# Altium schematic sheet 04_MCU-Part1.SchDoc
size A3; SheetNumber: 4; SheetTotal: 7
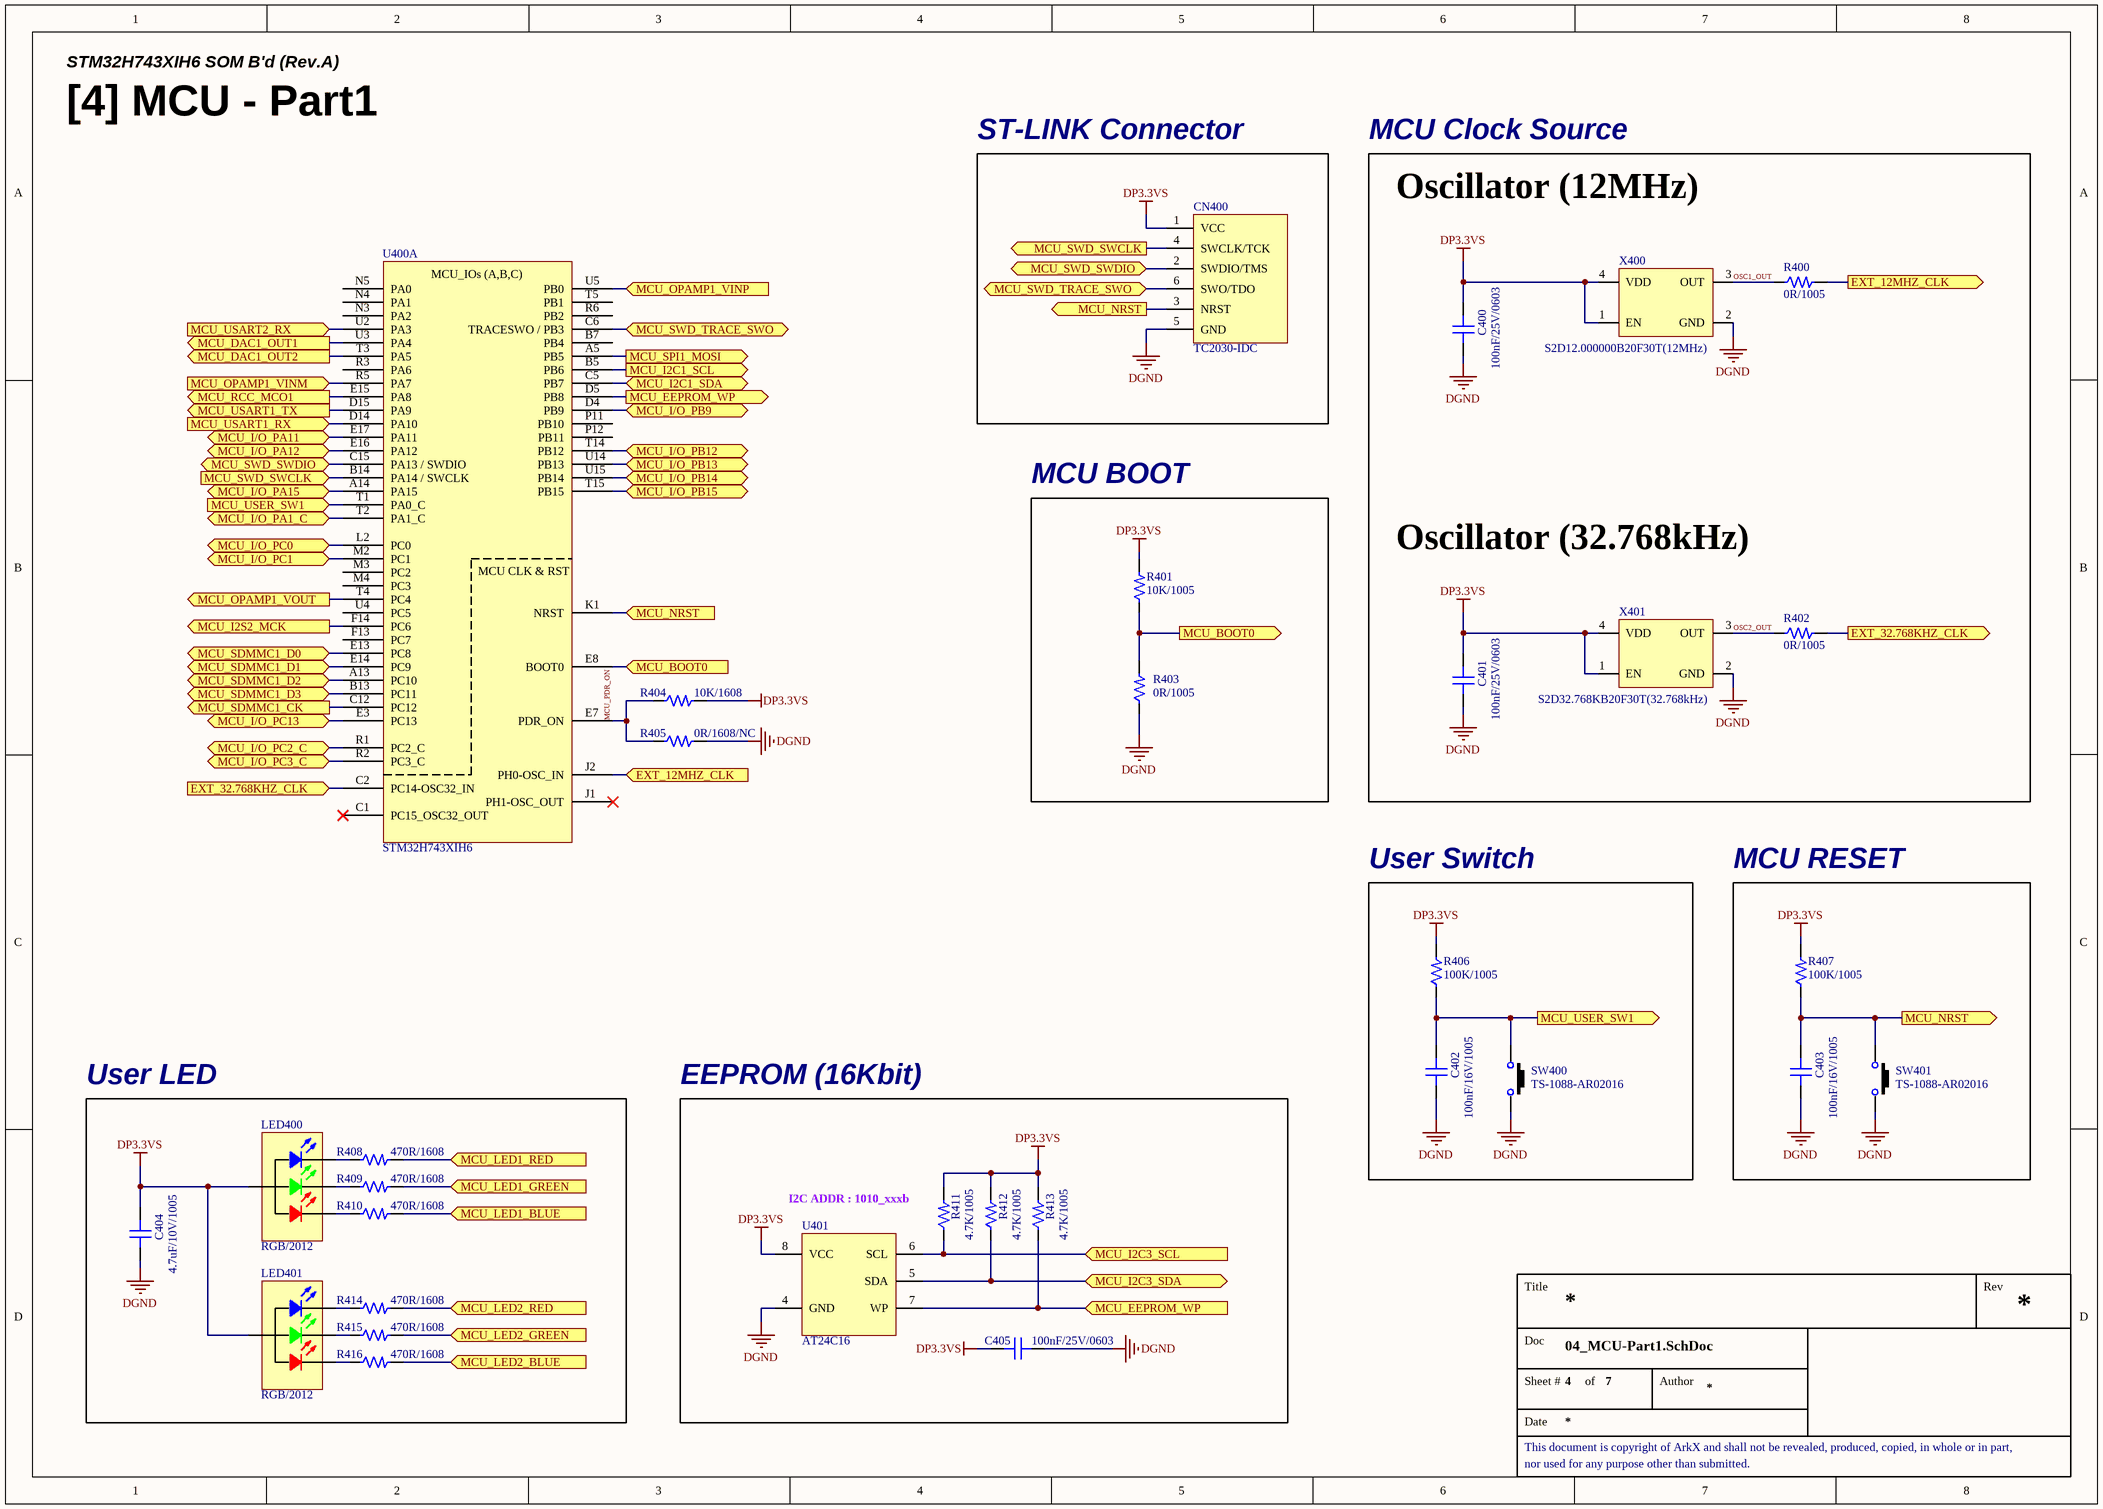
[diagram p0: 04_MCU-Part1.SchDoc]

## Parts
C400  100nF/25V/0603  [CAP 0603 (0201_INCH)]
C401  100nF/25V/0603  [CAP 0603 (0201_INCH)]
C402  100nF/16V/1005  [CAP 1005 (0402_INCH)]
C403  100nF/16V/1005  [CAP 1005 (0402_INCH)]
C404  4.7uF/10V/1005  [CAP 1005 (0402_INCH)]
C405  100nF/25V/0603  [CAP 0603 (0201_INCH)]
CN400  TC2030-IDC  [CON_TC2030-FP]  (no BOM)
LED400  RGB/2012  [LED MHT170RGBCT]
LED401  RGB/2012  [LED MHT170RGBCT]
R400  0R/1005  [RES 1005 (0402_inch)]
R401  10K/1005  [RES 1005 (0402_inch)]
R402  0R/1005  [RES 1005 (0402_inch)]
R403  0R/1005  [RES 1005 (0402_inch)]
R404  10K/1608  [RES 1608 (0603_inch)]
R405  0R/1608/NC  [RES 1608 (0603_inch)/NC]
R406  100K/1005  [RES 1005 (0402_inch)]
R407  100K/1005  [RES 1005 (0402_inch)]
R408  470R/1608  [RES 1608 (0603_inch)]
R409  470R/1608  [RES 1608 (0603_inch)]
R410  470R/1608  [RES 1608 (0603_inch)]
R411  4.7K/1005  [RES 1005 (0402_inch)]
R412  4.7K/1005  [RES 1005 (0402_inch)]
R413  4.7K/1005  [RES 1005 (0402_inch)]
R414  470R/1608  [RES 1608 (0603_inch)]
R415  470R/1608  [RES 1608 (0603_inch)]
R416  470R/1608  [RES 1608 (0603_inch)]
SW400  TS-1088-AR02016  [SW_TS-1088-AR02016]
SW401  TS-1088-AR02016  [SW_TS-1088-AR02016]
U400  STM32H743XIH6  [IC TFBGA-265]  (part A of 4)
U401  AT24C16  [TSSOP-8_PW (TI)]
X400  S2D12.000000B20F30T(12MHz)  [OSC SMD_2.5x2.0 (SCTF)]
X401  S2D32.768KB20F30T(32.768kHz)  [OSC SMD_2.5x2.0 (SCTF)]

## Blocks framed on the sheet
ST-LINK Connector: CN400
MCU BOOT: R401 R403
User Switch: C402 R406 SW400
MCU RESET: C403 R407 SW401
User LED: C404 LED400 LED401 R408-R410 R414-R416
EEPROM (16Kbit): C405 R411-R413 U401

## Ports
EXT_12MHZ_CLK (in), EXT_12MHZ_CLK (out), EXT_32.768KHZ_CLK (in), EXT_32.768KHZ_CLK (out), MCU_BOOT0 (in), MCU_BOOT0 (out), MCU_DAC1_OUT1 (out), MCU_DAC1_OUT2 (out), MCU_EEPROM_WP (in), MCU_EEPROM_WP (out), MCU_I2C1_SCL (out), MCU_I2C1_SDA (bidir), MCU_I2C3_SCL (in), MCU_I2C3_SDA (bidir), MCU_I2S2_MCK (out), MCU_I/O_PA1_C (bidir), MCU_I/O_PA11 (bidir), MCU_I/O_PA12 (bidir), MCU_I/O_PA15 (bidir), MCU_I/O_PB9 (bidir), MCU_I/O_PB12 (bidir), MCU_I/O_PB13 (bidir), MCU_I/O_PB14 (bidir), MCU_I/O_PB15 (bidir), MCU_I/O_PC0 (bidir), MCU_I/O_PC1 (bidir), MCU_I/O_PC2_C (bidir), MCU_I/O_PC3_C (bidir), MCU_I/O_PC13 (bidir), MCU_LED1_BLUE (in), MCU_LED1_GREEN (in), MCU_LED1_RED (in), MCU_LED2_BLUE (in), MCU_LED2_GREEN (in), MCU_LED2_RED (in), MCU_NRST (in), MCU_NRST (out), MCU_OPAMP1_VINM (in), MCU_OPAMP1_VINP (in), MCU_OPAMP1_VOUT (out), MCU_RCC_MCO1 (out), MCU_SDMMC1_CK (out), MCU_SDMMC1_D0 (bidir), MCU_SDMMC1_D1 (bidir), MCU_SDMMC1_D2 (bidir), MCU_SDMMC1_D3 (bidir), MCU_SPI1_MOSI (out), MCU_SWD_SWCLK (in), MCU_SWD_SWCLK (out), MCU_SWD_SWDIO (bidir), MCU_SWD_TRACE_SWO (bidir), MCU_USART1_RX (in), MCU_USART1_TX (out), MCU_USART2_RX (in), MCU_USER_SW1 (in), MCU_USER_SW1 (out)

## Nets
DGND: C400.2 C401.2 C402.1 C403.1 C404.1 C405.2 CN400.5(GND) R403.1 R405.2 SW400.2 SW401.2 U401.4(GND) X400.2(GND) X401.2(GND)
DP3.3VS: C400.1 C401.1 C404.2 C405.1 CN400.1(VCC) LED400.4(Common_Anode) LED401.4(Common_Anode) R401.2 R404.2 R406.2 R407.2 R411.2 R412.2 R413.2 U401.8(VCC) X400.1(EN) X400.4(VDD) X401.1(EN) X401.4(VDD)
EXT_12MHZ_CLK: R400.2 U400.J2(PH0-OSC_IN) ; port EXT_12MHZ_CLK
EXT_32.768KHZ_CLK: R402.2 U400.C2(PC14-OSC32_IN) ; port EXT_32.768KHZ_CLK
MCU_BOOT0: R401.1 R403.2 U400.E8(BOOT0) ; port MCU_BOOT0
MCU_DAC1_OUT1: U400.U3(PA4) ; port MCU_DAC1_OUT1
MCU_DAC1_OUT2: U400.T3(PA5) ; port MCU_DAC1_OUT2
MCU_EEPROM_WP: R413.1 U400.D5(PB8) U401.7(WP) ; port MCU_EEPROM_WP
MCU_I2C1_SCL: U400.B5(PB6) ; port MCU_I2C1_SCL
MCU_I2C1_SDA: U400.C5(PB7) ; port MCU_I2C1_SDA
MCU_I2C3_SCL: R411.1 U401.6(SCL) ; port MCU_I2C3_SCL
MCU_I2C3_SDA: R412.1 U401.5(SDA) ; port MCU_I2C3_SDA
MCU_I2S2_MCK: U400.F14(PC6) ; port MCU_I2S2_MCK
MCU_I/O_PA1_C: U400.T2(PA1_C) ; port MCU_I/O_PA1_C
MCU_I/O_PA11: U400.E17(PA11) ; port MCU_I/O_PA11
MCU_I/O_PA12: U400.E16(PA12) ; port MCU_I/O_PA12
MCU_I/O_PA15: U400.A14(PA15) ; port MCU_I/O_PA15
MCU_I/O_PB9: U400.D4(PB9) ; port MCU_I/O_PB9
MCU_I/O_PB12: U400.T14(PB12) ; port MCU_I/O_PB12
MCU_I/O_PB13: U400.U14(PB13) ; port MCU_I/O_PB13
MCU_I/O_PB14: U400.U15(PB14) ; port MCU_I/O_PB14
MCU_I/O_PB15: U400.T15(PB15) ; port MCU_I/O_PB15
MCU_I/O_PC0: U400.L2(PC0) ; port MCU_I/O_PC0
MCU_I/O_PC1: U400.M2(PC1) ; port MCU_I/O_PC1
MCU_I/O_PC2_C: U400.R1(PC2_C) ; port MCU_I/O_PC2_C
MCU_I/O_PC3_C: U400.R2(PC3_C) ; port MCU_I/O_PC3_C
MCU_I/O_PC13: U400.E3(PC13) ; port MCU_I/O_PC13
MCU_LED1_BLUE: R410.2 ; port MCU_LED1_BLUE
MCU_LED1_GREEN: R409.2 ; port MCU_LED1_GREEN
MCU_LED1_RED: R408.2 ; port MCU_LED1_RED
MCU_LED2_BLUE: R416.2 ; port MCU_LED2_BLUE
MCU_LED2_GREEN: R415.2 ; port MCU_LED2_GREEN
MCU_LED2_RED: R414.2 ; port MCU_LED2_RED
MCU_NRST: C403.2 CN400.3(NRST) R407.1 SW401.1 U400.K1(NRST) ; port MCU_NRST
MCU_OPAMP1_VINM: U400.R5(PA7) ; port MCU_OPAMP1_VINM
MCU_OPAMP1_VINP: U400.U5(PB0) ; port MCU_OPAMP1_VINP
MCU_OPAMP1_VOUT: U400.T4(PC4) ; port MCU_OPAMP1_VOUT
MCU_PDR_ON: R404.1 R405.1 U400.E7(PDR_ON)
MCU_RCC_MCO1: U400.E15(PA8) ; port MCU_RCC_MCO1
MCU_SDMMC1_CK: U400.C12(PC12) ; port MCU_SDMMC1_CK
MCU_SDMMC1_D0: U400.E13(PC8) ; port MCU_SDMMC1_D0
MCU_SDMMC1_D1: U400.E14(PC9) ; port MCU_SDMMC1_D1
MCU_SDMMC1_D2: U400.A13(PC10) ; port MCU_SDMMC1_D2
MCU_SDMMC1_D3: U400.B13(PC11) ; port MCU_SDMMC1_D3
MCU_SPI1_MOSI: U400.A5(PB5) ; port MCU_SPI1_MOSI
MCU_SWD_SWCLK: CN400.4(SWCLK/TCK) U400.B14(PA14_/_SWCLK) ; port MCU_SWD_SWCLK
MCU_SWD_SWDIO: CN400.2(SWDIO/TMS) U400.C15(PA13_/_SWDIO) ; port MCU_SWD_SWDIO
MCU_SWD_TRACE_SWO: CN400.6(SWO/TDO) U400.C6(TRACESWO_/_PB3) ; port MCU_SWD_TRACE_SWO
MCU_USART1_RX: U400.D14(PA10) ; port MCU_USART1_RX
MCU_USART1_TX: U400.D15(PA9) ; port MCU_USART1_TX
MCU_USART2_RX: U400.U2(PA3) ; port MCU_USART2_RX
MCU_USER_SW1: C402.2 R406.1 SW400.1 U400.T1(PA0_C) ; port MCU_USER_SW1
OSC1_OUT: R400.1 X400.3(OUT)
OSC2_OUT: R402.1 X401.3(OUT)
NetLED400_1: LED400.1(RED) R410.1
NetLED400_2: LED400.2(GREEN) R409.1
NetLED400_3: LED400.3(BLUE) R408.1
NetLED401_1: LED401.1(RED) R416.1
NetLED401_2: LED401.2(GREEN) R415.1
NetLED401_3: LED401.3(BLUE) R414.1

Not connected (* = marked no-connect by the designer): U400 B7(PB4) C1(PC15_OSC32_OUT)* F13(PC7) J1(PH1-OSC_OUT)* M3(PC2) M4(PC3) N3(PA2) N4(PA1) N5(PA0) P11(PB10) P12(PB11) R3(PA6) R6(PB2) T5(PB1) U4(PC5)

## Notes on the sheet
- STM32H743XIH6 SOM B'd (Rev.A)
- [4] MCU - Part1
- MCU Clock Source
- Oscillator (12MHz)
- Oscillator (32.768kHz)
- I2C ADDR : 1010_xxxb
- Title
- Rev
- Doc
- Sheet #
- of
- Author
- This document is copyright of ArkX and shall not be revealed, produced, copied, in whole or in part,
- Date
- nor used for any purpose other than submitted.
- (in symbol IC_MCU_STM32H743XIH6, part A) MCU_IOs (A,B,C); MCU CLK & RST

## Library data of the parts
C400 C401 C405 = CAP_100nF/25V/0603: Ceramic CAP_100nF/25V/0603; JLCPCB Part Type: Extended Part; LCSC Part #: C181047
C402 C403 = CAP_100nF/16V/1005: Ceramic CAP_100nF/16V/1005; LCSC Part #: C1525; JLCPCB Part Type: Basic Part
C404 = CAP_4.7uF/10V/1005: 10V 4.7uF X5R ±20% 0402  Multilayer Ceramic Capacitors MLCC - SMD/SMT ROHS; JLCPCB Part Type: Basic Part; LCSC Part #: C23733
CN400 = CON_TC2030-IDC: Tag-Connect No-Solder SWD Debug Connector DO NOT PLACE; Manufacturer Part Number: TC2030; Manufacturer: Tag-Connect
LED400 LED401 = LED_RGB_MHT170RGBCT: Colorless transparence -30℃~+85℃ Positive post Common anode RGB 120° 0805  Light Emitting Diodes (LED) ROHS; LCSC Part #: C2962094; JLCPCB Part Type: Extended Part
R400 R402 R403 = RES_0R/1005/62.5mW: Value: 0R; Power Rating: 62.5mW; Precision: 1%; Size: 1005; LCSC Part #: C17168; JLCPCB Part Type: Basic Part
R401 = RES_10K/1005/62.5mW: Value: 10K; Power Rating: 62.5mW; Precision: 1%; Size: 1005; LCSC Part #: C25744; JLCPCB Part Type: Basic Part
R404 = RES_10K/1608/0.1W: Value: 10K; Power Rating: 0.1W; Precision: 1%; Size: 1608; LCSC Part #: C25804; JLCPCB Part Type: Basic Part
R405 = RES_NC_0R/1608/0.1W: 0R/1608/0.1W/NC; Value: 0R; Power Rating: 0.1W; Precision: 1%; Size: 1608
R406 R407 = RES_100K/1005/62.5mW: Value: 100K; Power Rating: 62.5mW; Precision: 1%; Size: 1005; LCSC Part #: C25741; JLCPCB Part Type: Basic Part
R408-R410 R414-R416 = RES_470R/1608/0.1W: Value: 470R; Power Rating: 0.1W; Precision: 1%; Size: 1608; LCSC Part #: C23179; JLCPCB Part Type: Basic Part
R411-R413 = RES_4.7K/1005/62.5mW: Value: 4.7K; Power Rating: 62.5mW; Precision: 1%; Size: 1005; LCSC Part #: C25900; JLCPCB Part Type: Basic Part
SW400 SW401 = SW_TS-1088-AR02016: NO 50mA 100MΩ 100000 Times 12V 160gf@±50gf Brick nogging SPST SMD  Tactile Switches ROHS; LCSC Part #: C720477; JLCPCB Part Type: Extended Part
U400 = IC_MCU_STM32H743XIH6: ARM® Cortex®-M7 STM32H7 MCU IC 32bit Single-core 480MHz 2MB(2M x 8) Flash 240+25-TFBGA(14x14); LCSC Part #: C114407; JLCPCB Part Type: Extended Part
U401 = IC_EEPROM_AT24C16: IC EEPROM 16KBIT I2C 1MHZ 8TSSOP; LCSC Part #: C112954; JLCPCB Part Type: Extended Part
X400 = OSC_S2D12.000000B20F30T(12MHz): 3.3V~3.3V -40℃~+85℃ 20mA ±20ppm 12MHz SMD2520-4P  Oscillators ROHS; LCSC Part #: C387449; JLCPCB Part Type: Extended Part
X401 = OSC_S2D32.768KB20F30T(32.768kHz): 3.3V ±20ppm CMOS 32.768kHz SMD2520-4P  Oscillators ROHS; LCSC Part #: C387463; JLCPCB Part Type: Extended Part